# EAGLE design solarSwitcherV3.0 (EAGLE 7.3.0)
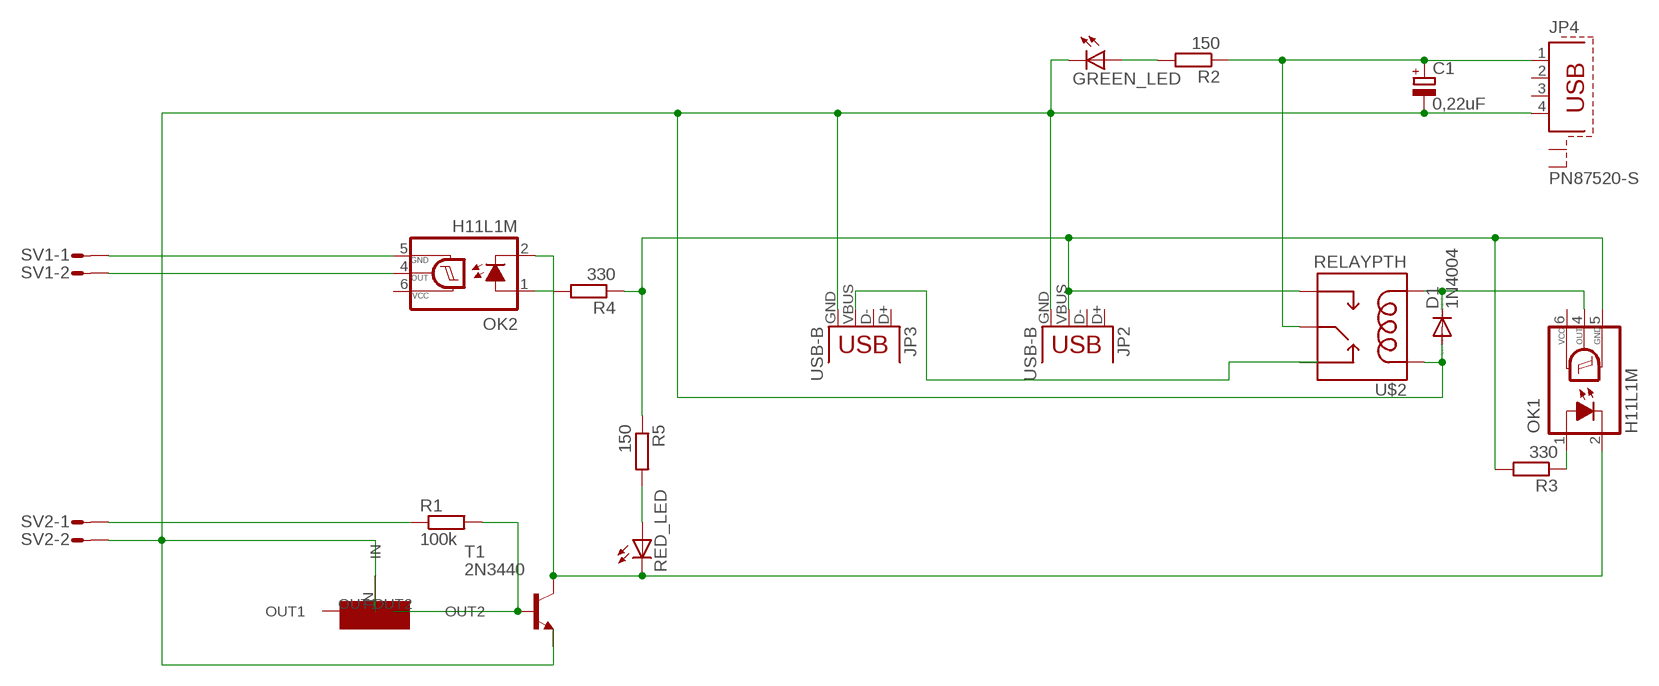
[diagram p0: schematic, sheet 1]

## Parts
C1  0,22uF  CPOL-EU150CLZ-1014  [150CLZ-1014]
D1  1N4004  [DO41-10]
GREEN_LED  LED5MM  [LED5MM]
JP2  USB-B  USBPTH  [USB-B-PTH]
JP3  USB-B  USBPTH  [USB-B-PTH]
JP4  PN87520-S  [PN87520-S]
OK1  H11L1M  [DIL06]
OK2  H11L1M  [DIL06]
R1  100k  R-EU_0207/10  [0207/10]
R2  150  R-EU_0207/10  [0207/10]
R3  330  R-EU_0207/10  [0207/10]
R4  330  R-EU_0207/10  [0207/10]
R5  150  R-EU_0207/10  [0207/10]
RED_LED  LED5MM  [LED5MM]
SV1  L02P  [L02P]
SV2  L02P  [L02P]
T1  2N3440  [TO5]
U$2  RELAYPTH  [SRD-05VDC-SL-C]
U$5  20k  POT_TRIMMER  [POT_TRIMMER]

## Nets
N$1: R1.2 T1.2(B) U$5.OUT2
N$3: OK2.1(A) R4.2
N$4: OK2.4(OUT) SV1.2
N$5: R1.1 SV2.1
N$6: JP3.VBUS U$2.SWCLOSED(SWCLOSE)
N$7: OK2.5(GND) SV1.1
N$8: C1.+ JP4.1 R2.1 U$2.SWCOMMON
N$9: OK1.2(C) OK2.2(C) RED_LED.K(C) T1.3(C)
N$12: JP2.VBUS OK1.5(GND) R3.2 R4.1 R5.1 U$2.SWOPEN
N$13: GREEN_LED.A R2.2
N$14: R5.2 RED_LED.A
N$15: C1.- D1.A GREEN_LED.K(C) JP2.GND JP3.GND JP4.4 SV2.2 T1.1(E) U$2.COIL1 U$5.IN
N$17: D1.C OK1.4(OUT) U$2.COIL0
N$18: OK1.1(A) R3.1
Unconnected: JP2.D+ JP2.D- JP3.D+ JP3.D- JP4.2 JP4.3 JP4.S1 JP4.S2 U$5.OUT1

## Power pins joined to a net without a drawn wire
VCC: OK1.6(VCC) OK2.6(VCC)

## Library data of the parts
C1 = rcl:CPOL-EU: POLARIZED CAPACITOR, European symbol
D1 = diode:1N4004: DIODE general purpose rectifier, 1 A
GREEN_LED RED_LED = led:LED: LED OSRAM: - CHIPLED LG R971, LG N971, LY N971, LG Q971, LY Q971, LO R971, LY R971 LH N974, LH R974 LS Q976, LO Q976, LY Q976 LO Q996 - Hyper CHIPLED LW Q18S LB Q993, LB Q99A, LB R99A - SideLED LS A670, LO A670, LY A670, LG A670, LP A670 LB A673, LV A673, LT A673, LW A673 LH A674 LY A675 LS A676, LA A676, LO A676, LY A676, LW A676 LS A679, LY A679, LG A679 - Hyper Micro SIDELED® LS Y876, LA Y876, LO Y876, LY Y876 LT Y87S - SmartLED LW L88C, LW L88S LB L89C, LB L89S, LG L890 LS L89K, LO L89K, LY L89K LS L896, LA L896, LO L896, LY L896 - TOPLED LS T670, LO T670, LY T670, LG T670, LP T670 LSG T670, LSP T670, LSY T670, LOP T670, LYG T670 LG T671, LOG T671, LSG T671 LB T673, LV T673, LT T673, LW T673 LH T674 LS T676, LA T676, LO T676, LY T676, LB T676, LH T676, LSB T676, LW T676 LB T67C, LV T67C, LT T67C, LS T67K, LO T67K, LY T67K, LW E67C LS E67B, LA E67B, LO E67B, LY E67B, LB E67C, LV E67C, LT E67C LW T67C LS T679, LY T679, LG T679 LS T770, LO T770, LY T770, LG T770, LP T770 LB T773, LV T773, LT T773, LW T773 LH T774 LS E675, LA E675, LY E675, LS T675 LS T776, LA T776, LO T776, LY T776, LB T776 LHGB T686 LT T68C, LB T68C - Hyper Mini TOPLED® LB M676 - Mini TOPLED Santana® LG M470 LS M47K, LO M47K, LY M47K Source: http://www.osram.convergy.de LUXEON: - LUMILED® LXK2-PW12-R00, LXK2-PW12-S00, LXK2-PW14-U00, LXK2-PW14-V00 LXK2-PM12-R00, LXK2-PM12-S00, LXK2-PM14-U00 LXK2-PE12-Q00, LXK2-PE12-R00, LXK2-PE12-S00, LXK2-PE14-T00, LXK2-PE14-U00 LXK2-PB12-K00, LXK2-PB12-L00, LXK2-PB12-M00, LXK2-PB14-N00, LXK2-PB14-P00, LXK2-PB14-Q00 LXK2-PR12-L00, LXK2-PR12-M00, LXK2-PR14-Q00, LXK2-PR14-R00 LXK2-PD12-Q00, LXK2-PD12-R00, LXK2-PD12-S00 LXK2-PH12-R00, LXK2-PH12-S00 LXK2-PL12-P00, LXK2-PL12-Q00, LXK2-PL12-R00 Source: www.luxeon.com KINGBRIGHT: KA-3528ASYC Source: www.kingbright.com
JP2 JP3 = SparkFun-Connectors:USB: USB Connectors USB-B-PTH is fully proven SKU : PRT-00139/CONN-08278 USB-miniB is fully proven SKU : PRT-00587 USB-A-PCB is untested. USB-A-H is throughly reviewed, but untested. Spark Fun Electronics SKU : PRT-00437 USB-B-SMT is throughly reviewed, but untested. Needs silkscreen touching up. USB-A-S has not been used/tested USB-MB-H has not been used/tested USB-MICROB has been used. CONN-09505; PROD_ID: CONN-08278
JP4 = con-berg:PN87520-S; OC_FARNELL: unknown; OC_NEWARK: unknown
OK1 OK2 = optocoupler:H11L*M: 6-Pin DIP Optocoupler Source: http://www.fairchildsemi.com/ds/H1/H11L2-M.pdf; MF: FAIRCHILD SEMICONDUCTOR; MPN: H11L1-M; OC_FARNELL: 1021127; OC_NEWARK: 72K8643
R1-R5 = resistor:R-EU_: RESISTOR, European symbol
SV1 SV2 = con-amp-mt:L02P: AMP MT CONNECTOR; OC_FARNELL: unknown; OC_NEWARK: unknown
T1 = transistor:2N3440: NPN TRANSISTOR
U$2 = SRD-05VDC-SL-C:RELAY: SPDT relay (COM-00101)
U$5 = MBLIB:POT_TRIMMER

## Board
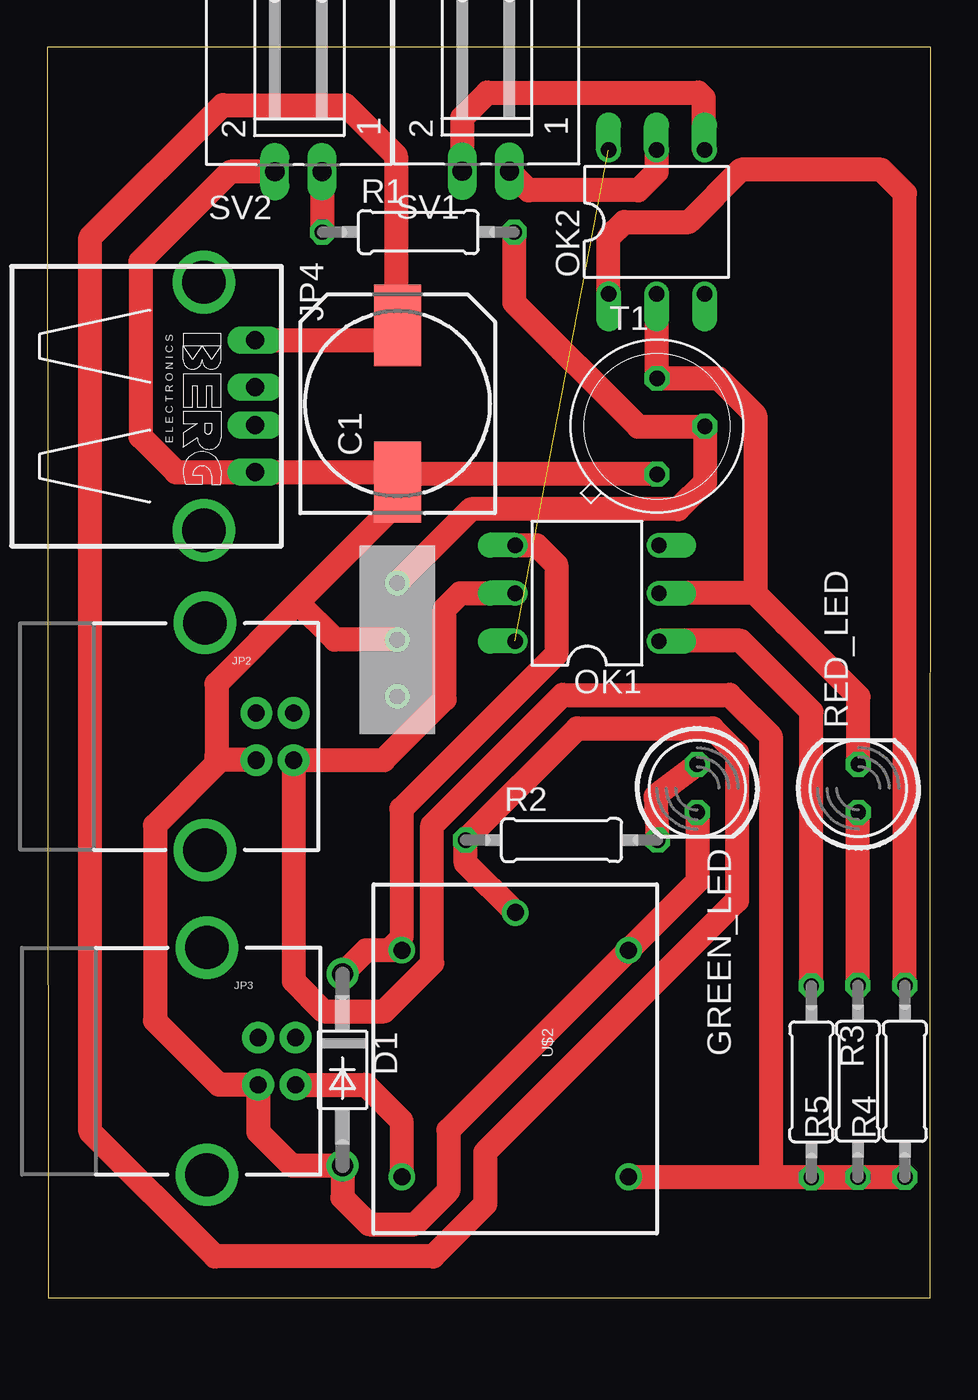
[diagram p1: board, top side]
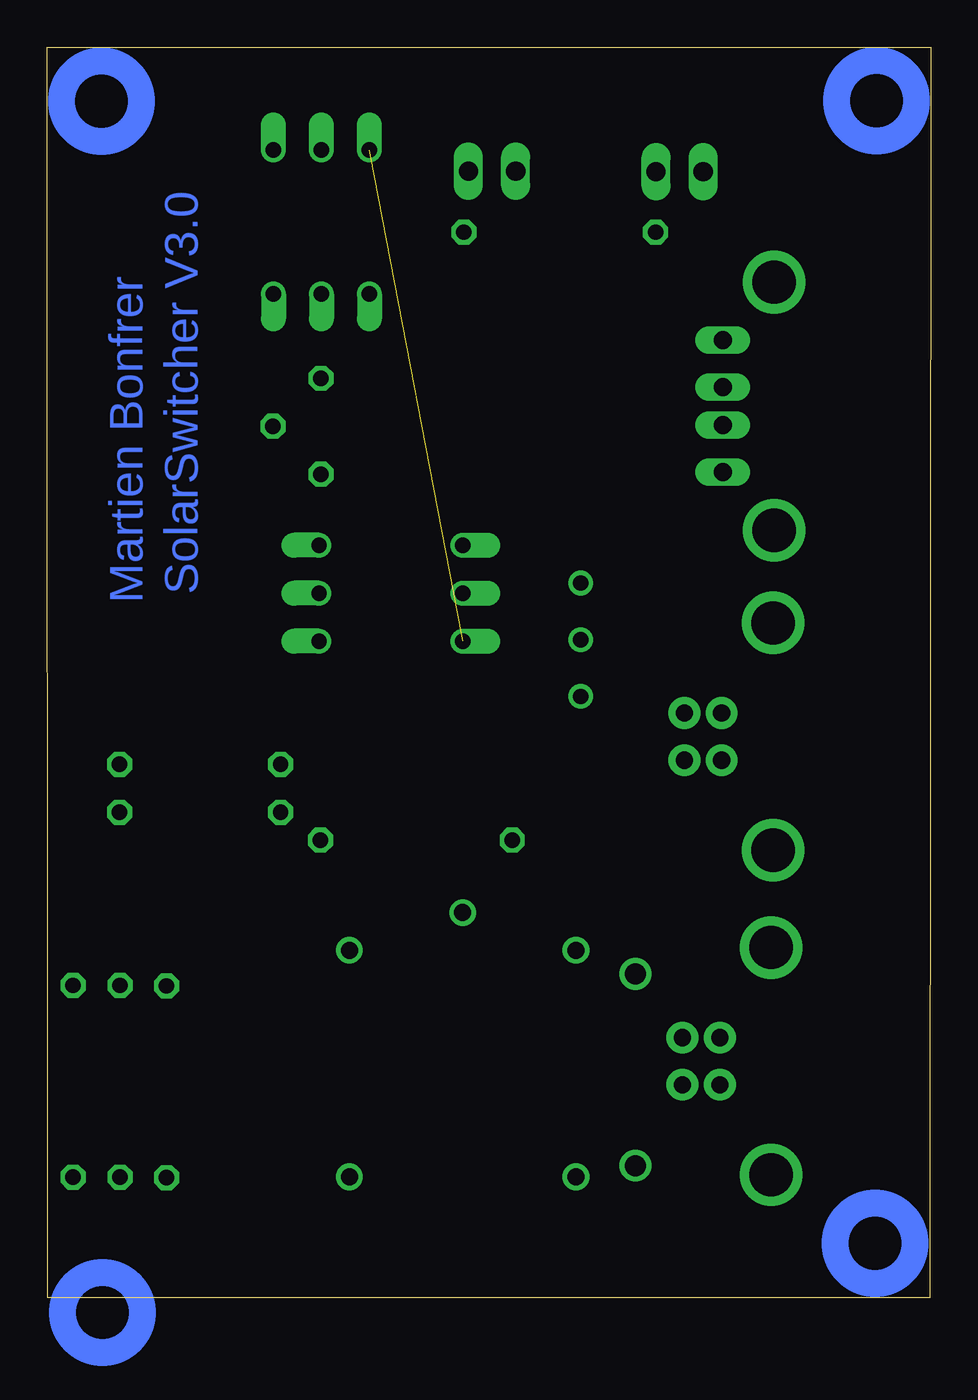
[diagram p2: board, bottom side, seen from below]

Size 46.81 x 66.23 mm. Coordinates in mm from the lower left corner, seen from the top.
Outline: 0.05,0 46.79,0 46.81,66.23 0,66.23 0.05,0
Copper layers (1*16): Top 0.035mm / dielectric 1.5mm / Bottom 0.035mm
Design rules "default": minimum track width 10mil, minimum drill 24mil, track to track 8mil, track to pad 8mil, pad to pad 8mil, via to via 8mil, smd to smd 8mil, copper to edge 40mil, drill to drill 8mil, minimum pad ring 10mil, minimum via ring 8mil, stop-mask expansion 4mil, vias tented up to drill 0mil, thermal gap 10mil

### Footprints (pad centres in the part's own frame; a part is rotated, then mirrored left to right if it is on the bottom)
150CLZ-1014 = smd 4.3 x 2.5: + 4.15,0; - -4.15,0
DO41-10 = drill 1.118: A 5.08,0; C -5.08,0
LED5MM = drill 0.813 octagon: A -1.27,0; K 1.27,0
USB-B-PTH = drill 0.914 pad 1.676: D+ 0,1.25; D- 1.981,1.25; GND 0,-1.25; VBUS 1.981,-1.25 | drill 2.286: S1 -2.718,-6.02; S2 -2.718,6.02
PN87520-S = drill 0.95 long: 1 -3.5,2.71; 2 -1,2.71; 3 1,2.71; 4 3.5,2.71 | drill 2.3 pad 2.9: S1 -6.57,0; S2 6.57,0
DIL06 = drill 0.813 offset: 1 -2.54,-3.81; 2 0,-3.81; 3 2.54,-3.81; 4 2.54,3.81; 5 0,3.81; 6 -2.54,3.81
0207/10 = drill 0.813 octagon: 1 -5.08,0; 2 5.08,0
L02P = drill 1.016 long: 1 1.25,-6.25; 2 -1.25,-6.25
TO5 = drill 0.813 octagon: 1 0,-2.54; 2 2.54,0; 3 0,2.54
SRD-05VDC-SL-C = drill 0.9: COIL0 -5.39,-6.12; COIL1 -5.39,5.88; SWCLOSED 6.61,-6.12; SWCOMMON -7.39,-0.12; SWOPEN 6.61,5.88
POT_TRIMMER = drill 0.8: IN 5,2; OUT1 2,2; OUT2 8,2

### Placement (x,y rotation side)
C1  18.57,47.35 90 top
D1  15.65,12.06 270 top
GREEN_LED  34.44,26.97 270 top
JP2  11.07,29.72 0 top
JP3  11.18,12.52 0 top
JP4  8.31,47.22 270 top
OK1  28.6,37.31 90 top
OK2  32.28,56.97 0 top
R1  19.66,56.44 0 top
R2  27.25,24.23 0 top
R3  40.49,11.43 270 top
R4  45.44,11.46 90 top
R5  42.95,11.46 90 top
RED_LED  42.98,26.97 90 top
SV1  23.24,65.91 0 top
SV2  13.31,65.89 0 top
T1  32.31,46.15 0 top
U$2  24.92,13 270 top
U$5  20.55,29.84 90 top

### Tracks (layer width: path | path; a pad name or v marks a point on that pad's centre or on a via)
N$1
  Top 1.27: R1.2 24.74,52.7 31.32,46.13 34.82,46.13 T1.2 34.85,43.18 33.43,41.76 22.46,41.76 U$5.OUT2
N$3
  Top 1.27: R4.2 45.44,58.5 44.2,59.74 36.75,59.74 33.99,56.97 30.58,56.97 29.74,56.13 OK2.1
N$4
  Top 1.27: SV1.2 21.99,62.5 23.32,63.83 34.49,63.83 34.77,63.55 34.77,60.83 OK2.4
N$5
  Top 1.27: SV2.1 14.56,56.46 R1.1
N$6
  Top 1.27: JP3.VBUS 16.87,11.27 18.77,9.37 18.77,6.42 U$2.SWCLOSED
N$7
  Top 1.27: OK2.5 32.28,59.61 31.32,58.65 25.51,58.65 SV1.1
N$8
  Top 1.27: JP4.1 18.16,50.72 18.39,50.95 18.39,51.32 C1.+ 18.57,51.1 18.48,51.02 | 18.48,51.02 18.36,50.9 | U$2.SWCOMMON 22.17,23.02 R2.1 28.09,30.15 35.26,30.15 36.55,28.85 36.55,21.03 23.21,7.69 23.21,4.94 20.45,2.18 8.89,2.18 2.29,8.79 2.29,56.16 9.3,63.17 15.8,63.17 18.48,60.49 18.48,51.02
N$9
  Top 1.27: OK2.2 32.28,48.72 T1.3 35.56,48.69 37.52,46.74 37.52,37.29 | RED_LED.K 42.98,31.83 39.1,35.7 37.52,37.29 | 37.52,37.29 37.49,37.31 OK1.2
N$12
  Top 1.27: U$2.SWOPEN 38.3,6.39 | 38.3,6.39 45.4,6.39 R4.1 45.39,6.4 R5.1 R3.2 | OK1.5 21.9,37.31 21.06,36.47 21.06,31.7 17.83,28.47 JP2.VBUS 13.06,16.76 14.66,15.16 17.86,15.16 20.4,17.7 20.4,25.02 27.31,31.93 36.14,31.93 38.33,29.74 38.33,6.42 38.3,6.39
N$13
  Top 1.27: GREEN_LED.A 32.23,26.57 R2.2
N$14
  Top 1.27: R5.2 42.95,25.68 RED_LED.A
N$15
  Top 1.27: SV2.2 9.7,59.64 4.95,54.89 4.95,45.59 6.83,43.71 JP4.4 18.88,43.72 18.98,43.61 | JP2.GND 9.16,28.47 | 9.16,28.47 5.72,25.02 5.72,14.66 9.1,11.27 JP3.GND 11.2,11.25 11.2,8.76 12.98,6.98 D1.A | 9.16,28.47 8.97,28.67 8.97,32.51 13.27,36.82 | 15.67,6.96 D1.A | T1.1 18.98,43.61 | 18.98,43.61 C1.- 18.57,42.11 13.27,36.82 | GREEN_LED.K 34.44,22.04 U$2.COIL1 21.26,8.86 21.26,5.66 19.48,3.89 17.04,3.89 15.65,5.28 D1.A | U$5.IN 15.24,34.84 13.27,36.82
N$17
  Top 1.27: 18.85,18.39 U$2.COIL0 18.11,18.39 | 18.11,18.39 16.9,18.39 D1.C | OK1.4 25.93,39.85 26.98,38.81 26.98,34.09 18.77,25.88 18.77,19.06 18.11,18.39
N$18
  Top 1.27: R3.1 40.49,31.04 36.73,34.8 32.44,34.8 OK1.1
VCC  (1 unrouted)
(copper drawn outside any net)
  shapes: Bottom circle x4

### Text on the board
Bottom: Martien Bonfrer | SolarSwitcher V3.0